# Altium schematic sheet Bitcoiner_EB_Project_V1I1_Schematic.SchDoc: Bitcoiner Expansion Board (part 2 of 3)
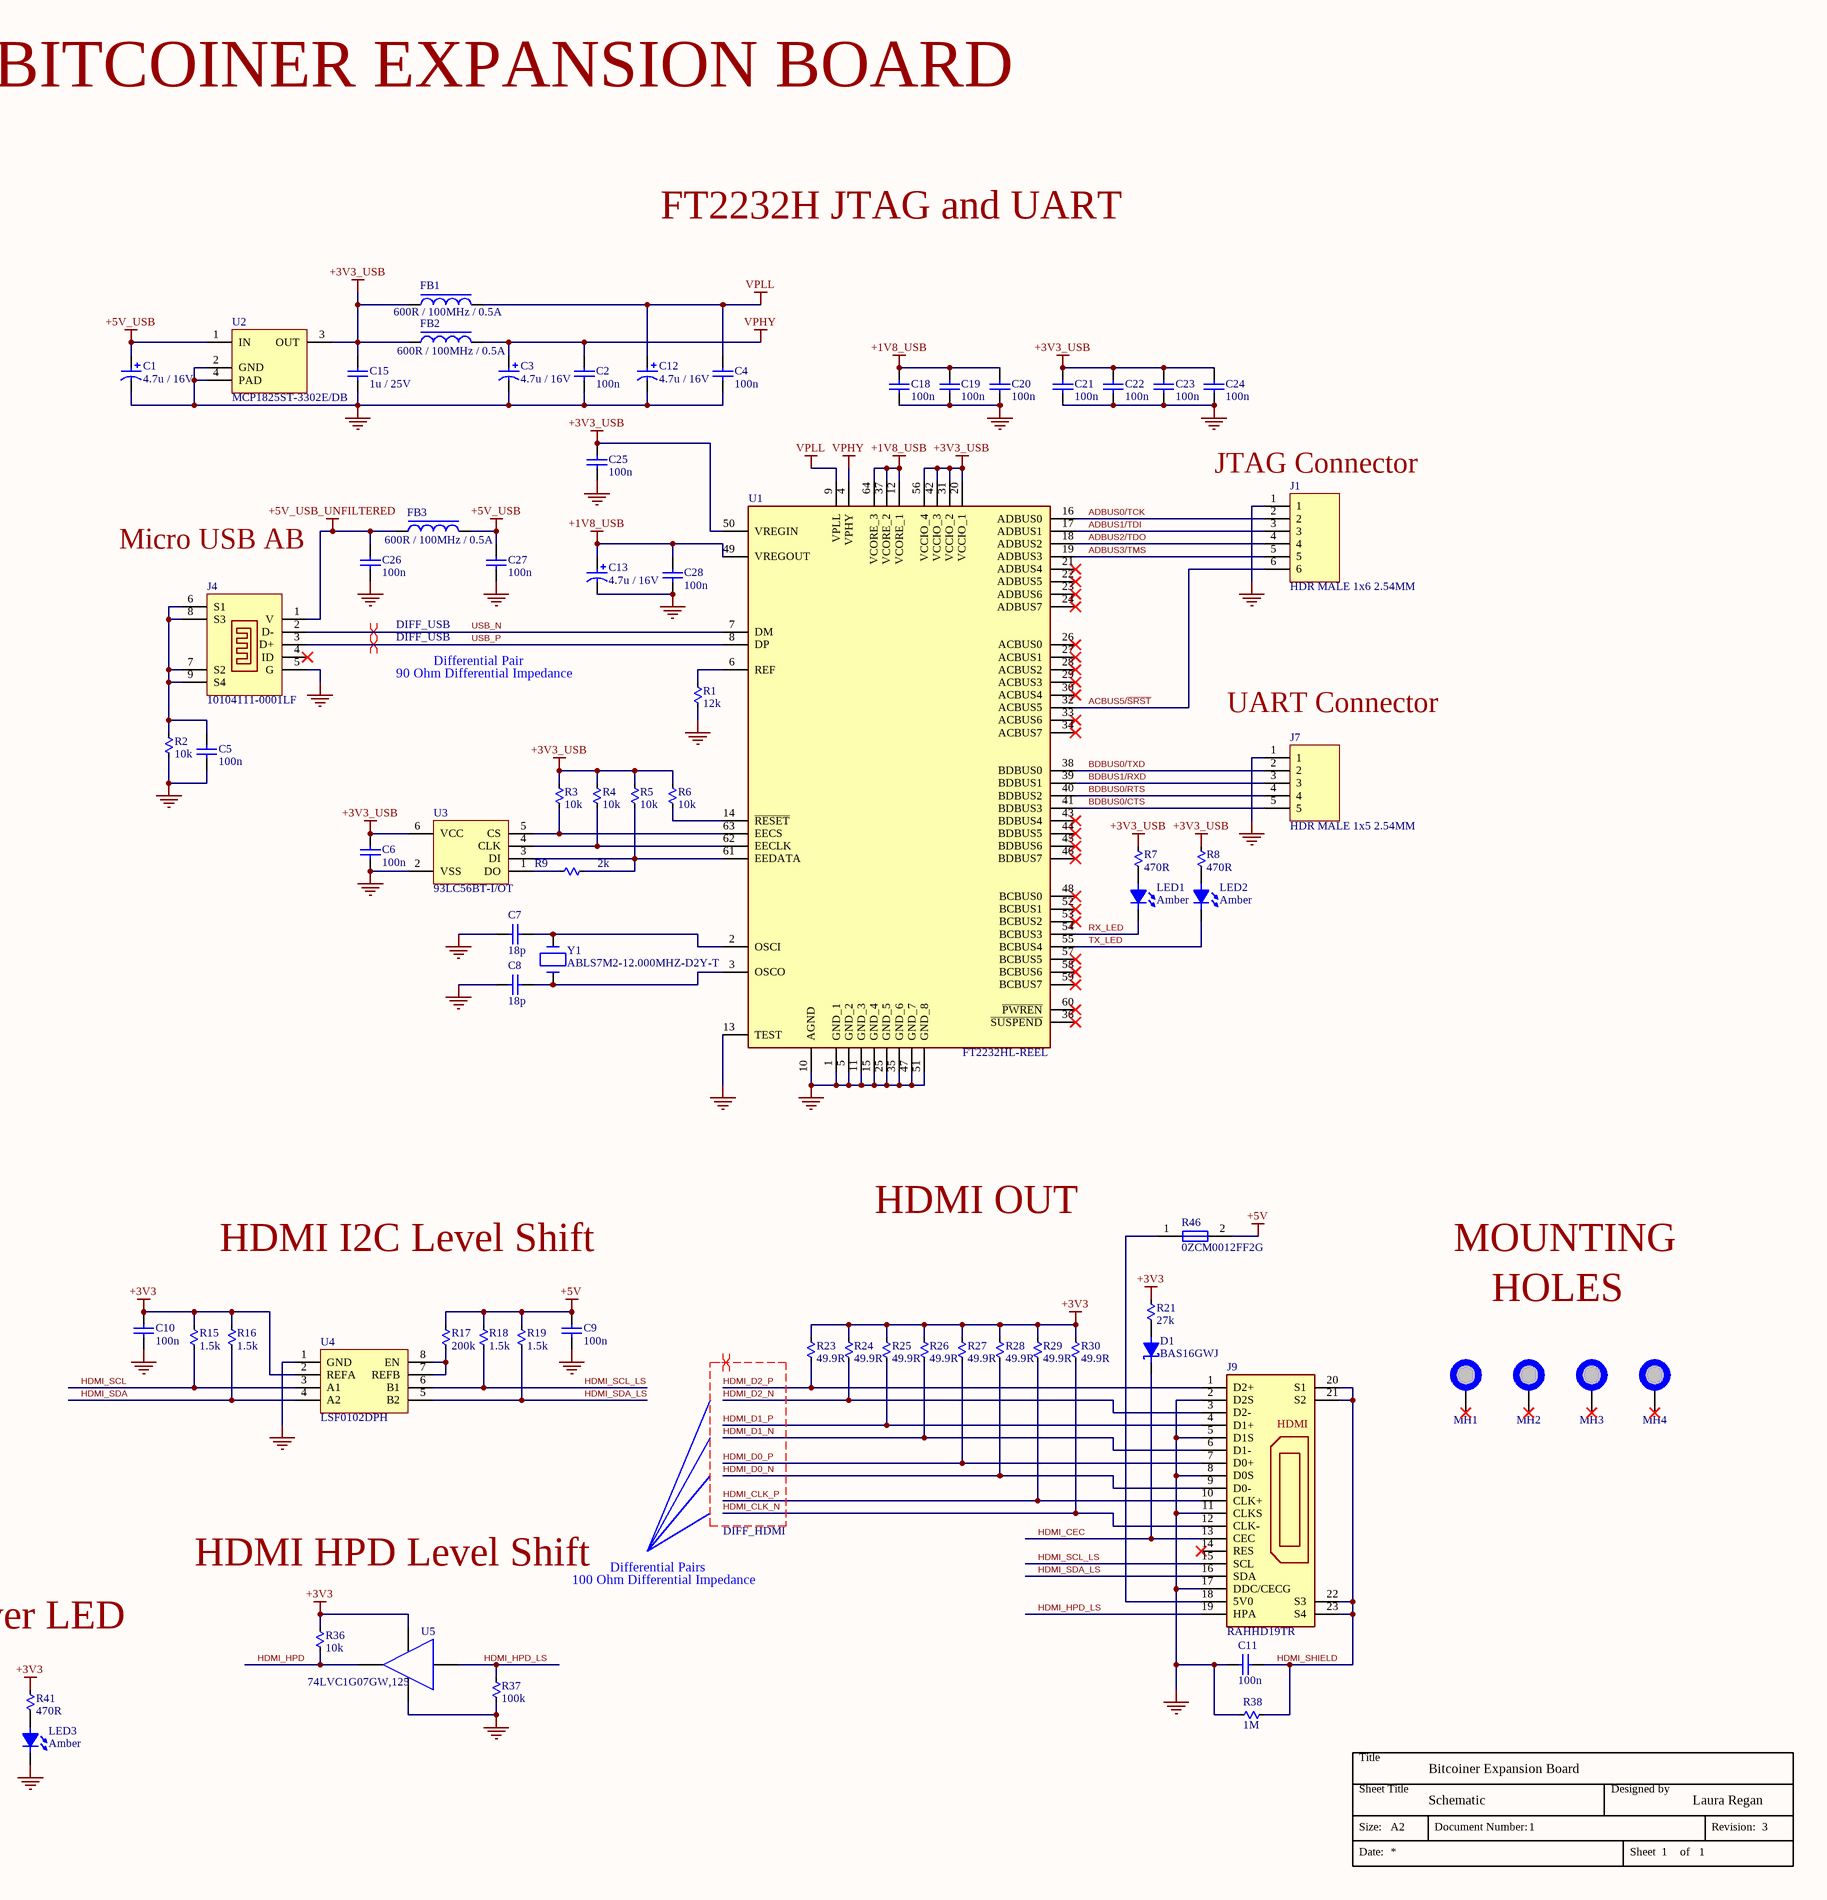
[diagram p2: Bitcoiner_EB_Project_V1I1_Schematic.SchDoc, right]
## Library data of the parts
C1 C3 C12 C13 C33 = T491A475K016AT: Tantalum capacitor 4.7 uF 16 VDC, T491A475K016AT, KEMET; Capacitance: 4.7uF; Tolerance: 10%; ESR (Equivalent Series Resistance): 4R; Polarity: Polar; Dissipation Factor: 6%; Life (Hours): 2000Hour; Ripple Current: 137mA; Leakage Current: 800nA; Supplier 1: Mouser; Manufacturer: KEMET; Manufacturer Part Number: T491A475K016AT; RoHS: Yes; Category: Tantalum Capacitors; Stock 1: 9766; Pricing 1: 1=0.43000, 10=0.24500, 50=0.24500, 100=0.14900, 1000=0.12200, 10000=0.10600 (USD); Mount: Surface Mount,PCB; Case/Package: 1206; Number of Pins: 2; Case Code (Metric): 3216; Case Code (Imperial): 1206; Dielectric Material: Tantalum; Min Operating Temperature: -55°C; Max Operating Temperature: 125°C; Packaging: Tape and Reel; Construction: Flat; Voltage Rating: 16V; Features: General Purpose; Package Quantity: 1; Voltage Rating (DC): 16V; Termination: SMD/SMT; Voltage: 16V; Series: T491; Length: 3.2mm; Width: 1.6mm; Height: 1.6mm; Depth: 1.6mm; Height - Seated (Max): 0.071inch; Radiation Hardening: No; RoHS Compliant: Yes; Lead Free: Lead Free; REACH SVHC: No SVHC; ComponentLink1URL: https://datasheet.ciiva.com/34302/1573425-34302513.pdf?src-supplier=Jameco; ComponentLink1Description: https://datasheet.ciiva.com/34302/1573425-34302513.pdf?src-supplier=Jameco; ComponentLink2URL: https://datasheet.ciiva.com/11793/0900766b80718482-11793043.pdf?src-supplier=RSComponents; ComponentLink2Description: https://datasheet.ciiva.com/11793/0900766b80718482-11793043.pdf?src-supplier=RSComponents; ComponentLink3URL: https://datasheet.ciiva.com/20171/458253-da-en-01-20171911.pdf?src-supplier=Rapid+Electronics; ComponentLink3Description: https://datasheet.ciiva.com/20171/458253-da-en-01-20171911.pdf?src-supplier=Rapid+Electronics; ComponentLink4URL: https://datasheet.ciiva.com/257/kem-t2005-t491-257536.pdf?src-supplier=Digi-Key; ComponentLink4Description: https://datasheet.ciiva.com/257/kem-t2005-t491-257536.pdf?src-supplier=Digi-Key; ComponentLink5URL: https://datasheet.ciiva.com/257/kem-t2005-t491-257537.pdf?src-supplier=Digi-Key; ComponentLink5Description: https://datasheet.ciiva.com/257/kem-t2005-t491-257537.pdf?src-supplier=Digi-Key; ComponentLink6URL: https://datasheet.ciiva.com/257/kem-t2005-t491-257538.pdf?src-supplier=Digi-Key; ComponentLink6Description: https://datasheet.ciiva.com/257/kem-t2005-t491-257538.pdf?src-supplier=Digi-Key; ComponentLink7URL: https://datasheet.ciiva.com/7696/1854511-7696309.pdf?src-supplier=Element14; ComponentLink7Description: https://datasheet.ciiva.com/7696/1854511-7696309.pdf?src-supplier=Element14; ComponentLink8URL: https://datasheet.ciiva.com/14605/70095774-14605189.pdf?src-supplier=Allied+Electronics; ComponentLink8Description: https://datasheet.ciiva.com/14605/70095774-14605189.pdf?src-supplier=Allied+Electronics; ComponentLink9URL: https://datasheet.ciiva.com/7696/1854511-7696310.pdf?src-supplier=Element14; ComponentLink9Description: https://datasheet.ciiva.com/7696/1854511-7696310.pdf?src-supplier=Element14; ComponentLink10URL: https://datasheet.ciiva.com/7696/1854511-7696311.pdf?src-supplier=Element14; ComponentLink10Description: https://datasheet.ciiva.com/7696/1854511-7696311.pdf?src-supplier=Element14; ComponentLink11URL: https://datasheet.ciiva.com/7696/1854511-7696312.pdf?src-supplier=Element14; ComponentLink11Description: https://datasheet.ciiva.com/7696/1854511-7696312.pdf?src-supplier=Element14; ComponentLink12URL: https://datasheet.ciiva.com/12883/kem-t2005-t491-12883130.pdf?src-supplier=Mouser; ComponentLink12Description: https://datasheet.ciiva.com/12883/kem-t2005-t491-12883130.pdf?src-supplier=Mouser; ComponentLink13URL: https://datasheet.ciiva.com/14603/70095774-14603739.pdf?src-supplier=Allied+Electronics; ComponentLink13Description: https://datasheet.ciiva.com/14603/70095774-14603739.pdf?src-supplier=Allied+Electronics; ComponentLink14URL: https://datasheet.ciiva.com/5934/kem-t2005-t491-5934799.pdf?src-supplier=Farnell; ComponentLink14Description: https://datasheet.ciiva.com/5934/kem-t2005-t491-5934799.pdf?src-supplier=Farnell; ComponentLink15URL: https://datasheet.ciiva.com/29244/458253-da-01-en-tantal-kondensator-t491a475k016at-29244572.pdf?src-supplier=Conrad; ComponentLink15Description: https://datasheet.ciiva.com/29244/458253-da-01-en-tantal-kondensator-t491a475k016at-29244572.pdf?src-supplier=Conrad; Supplier Part Number 1: 80-T491A475K016
C2 C4-C6 C9-C11 C16 C18-C28 C30 = 08055C104KAT4A: AVX - 08055C104KAT4A - Multilayer Ceramic Capacitor, 0.1 F, 10%, X7R, 50 V, 0805 [2012 Metric] RoHS Compliant: Yes; Manufacturer: Kyocera AVX; Capacitance: 100nF; Voltage Rating: 50V; Dissipation Factor: 2.5%; Supplier 1: Mouser; Manufacturer Part Number: 08055C104KAT4A; RoHS: Yes; Category: Ceramic Capacitors; Stock 1: 466031; Pricing 1: 1=0.10000, 10=0.04000, 50=0.04000, 100=0.03300, 1000=0.01900, 10000=0.01500 (USD); Mount: Surface Mount; Case/Package: 0805; Number of Pins: 2; Case Code (Imperial): 0805; Case Code (Metric): 2012; Dielectric Material: Ceramic; Min Operating Temperature: -55°C; Max Operating Temperature: 125°C; Tolerance: 10%; Dielectric: X7R; Packaging: Tape and Reel; Voltage Rating (DC): 50V; Package Quantity: 15000; Termination: SMD/SMT; Voltage: 50V; Construction: Flat; Length: 2.01mm; Width: 1.25mm; Height: 0.94mm; Depth: 1.25mm; Radiation Hardening: No; REACH SVHC: No SVHC; Lead Free: Lead Free; RoHS Compliant: Yes; ComponentLink1URL: https://datasheet.ciiva.com/2988/cx7r-2988016.pdf?src-supplier=Avnet; ComponentLink1Description: https://datasheet.ciiva.com/2988/cx7r-2988016.pdf?src-supplier=Avnet; ComponentLink2URL: https://datasheet.ciiva.com/28613/1679506-28613114.pdf?src-supplier=Element14; ComponentLink2Description: https://datasheet.ciiva.com/28613/1679506-28613114.pdf?src-supplier=Element14; ComponentLink3URL: https://datasheet.ciiva.com/5423/cx7r-218113-5423437.pdf?src-supplier=Mouser; ComponentLink3Description: https://datasheet.ciiva.com/5423/cx7r-218113-5423437.pdf?src-supplier=Mouser; ComponentLink4URL: https://datasheet.ciiva.com/16222/cx7r-16222253.pdf?src-supplier=Future+Electronics; ComponentLink4Description: https://datasheet.ciiva.com/16222/cx7r-16222253.pdf?src-supplier=Future+Electronics; ComponentLink5URL: https://datasheet.ciiva.com/22676/1679506-22676605.pdf?src-supplier=Element14; ComponentLink5Description: https://datasheet.ciiva.com/22676/1679506-22676605.pdf?src-supplier=Element14; ComponentLink6URL: https://datasheet.ciiva.com/2988/cx7r-2988015.pdf?src-supplier=Avnet; ComponentLink6Description: https://datasheet.ciiva.com/2988/cx7r-2988015.pdf?src-supplier=Avnet; Supplier Part Number 1: 581-08055C104KAT4A
C7 C8 = C0805C180J5GAC: Cap Ceramic 18pF 50V C0G 5% Pad SMD 0805 125°C Extreme Low ESR Bag; Manufacturer: KEMET; Supplier 1: Mouser; Manufacturer Part Number: C0805C180J5GAC; RoHS: Yes; Category: Ceramic Capacitors; Stock 1: 13285; Pricing 1: 1=0.11000, 10=0.04800, 50=0.04800, 100=0.03400, 1000=0.02300, 10000=0.01600 (USD); Mount: Surface Mount; Case/Package: 0805; Number of Pins: 2; Dielectric Material: Ceramic; Case Code (Imperial): 0805; Case Code (Metric): 2012; Min Operating Temperature: -55°C; Max Operating Temperature: 125°C; Capacitance: 18pF; Tolerance: 5%; Dielectric: C0G; Voltage Rating (DC): 50V; Packaging: Tape and Reel; Termination: SMD/SMT; Package Quantity: 4000; Series: C0805C; Construction: Flat; Length: 2mm; Width: 1.2mm; Height: 0.78mm; Depth: 1.25mm; Radiation Hardening: No; Lead Free: Lead Free; RoHS Compliant: Yes; ComponentLink1URL: https://datasheet.ciiva.com/11651/kem-c1003-c0g-smd-11651038.pdf?src-supplier=Avnet; ComponentLink1Description: https://datasheet.ciiva.com/11651/kem-c1003-c0g-smd-11651038.pdf?src-supplier=Avnet; Supplier Part Number 1: 80-C0805C180J5GAC
C14 C15 = C0805C105K3RAC7210: Cap Ceramic 1uF 25V X7R 10% SMD 0805 125C Plastic T/R; Manufacturer: KEMET; Supplier 1: Mouser; Manufacturer Part Number: C0805C105K3RAC7210; RoHS: Yes; Category: Ceramic Capacitors; Stock 1: 18487; Pricing 1: 1=0.14000, 10=0.05600, 50=0.05600, 100=0.04600, 1000=0.02700, 10000=0.02200 (USD); Mount: Surface Mount; Case/Package: 0805; Dielectric Material: Ceramic; Min Operating Temperature: -55°C; Max Operating Temperature: 125°C; Capacitance: 1uF; Tolerance: 10%; Dielectric: X7R; Packaging: Tape and Reel; Voltage Rating (DC): 25V; Construction: Flat; Length: 2mm; Height: 1.25mm; Depth: 1.25mm; Radiation Hardening: No; RoHS Compliant: Yes; ComponentLink1URL: https://datasheet.ciiva.com/16623/datasheetpn-c0805c105k3rac7210-16623618.pdf?src-supplier=Avnet+Europe; ComponentLink1Description: https://datasheet.ciiva.com/16623/datasheetpn-c0805c105k3rac7210-16623618.pdf?src-supplier=Avnet+Europe; ComponentLink2URL: https://datasheet.ciiva.com/26847/getdatasheetpartid-385653-26847803.pdf?src-supplier=Verical; ComponentLink2Description: https://datasheet.ciiva.com/26847/getdatasheetpartid-385653-26847803.pdf?src-supplier=Verical; Supplier Part Number 1: 80-C0805C105K3R7210
C17 C29 = GRM21BR61E106KA73K: CAP CER 10UF 25V X5R 0805; Manufacturer: Murata; Tolerance: 10%; Supplier 1: Mouser; Manufacturer Part Number: GRM21BR61E106KA73K; RoHS: Yes; Category: Ceramic Capacitors; Stock 1: 5264; Pricing 1: 1=0.23000, 10=0.09400, 50=0.09400, 100=0.08000, 1000=0.04900, 10000=0.03900 (USD); Mount: Surface Mount; Case/Package: 0805; Weight: 0.000335oz; Min Operating Temperature: -55°C; Max Operating Temperature: 85°C; Packaging: Tape and Reel; Capacitance: 10uF; Voltage Rating: 25V; Package Quantity: 10000; Dielectric: X5R; Voltage Rating (DC): 25V; Length: 0.079inch; Width: 0.049inch; Thickness: 0.055inch; RoHS Compliant: Yes; ComponentLink1URL: http://www.mouser.com/ds/2/281/c02e-2905.pdf?src-supplier=Mouser; ComponentLink1Description: http://www.mouser.com/ds/2/281/c02e-2905.pdf?src-supplier=Mouser; ComponentLink2URL: http://search.murata.co.jp/Ceramy/image/img/A01X/G101/ENG/GRM21BR61E106KA73-01.pdf?src-supplier=Digi-Key; ComponentLink2Description: http://search.murata.co.jp/Ceramy/image/img/A01X/G101/ENG/GRM21BR61E106KA73-01.pdf?src-supplier=Digi-Key; ComponentLink3URL: https://search.murata.co.jp/Ceramy/image/img/A01X/G101/ENG/GRM21BR61E106KA73-01.pdf?src-supplier=Digi-Key; ComponentLink3Description: https://search.murata.co.jp/Ceramy/image/img/A01X/G101/ENG/GRM21BR61E106KA73-01.pdf?src-supplier=Digi-Key; Supplier Part Number 1: 81-GRM21BR61E106KA3K
C31 C32 = CL21A226MPCLRNC: Cap Ceramic 22uF 10V X5R 20% SMD 0805 85C Cardboard T/R; Manufacturer: Samsung; Supplier 1: Mouser; Manufacturer Part Number: CL21A226MPCLRNC; RoHS: Yes; Category: Ceramic Capacitors; Stock 1: 45867; Pricing 1: 1=0.26000, 10=0.11700, 50=0.11700, 100=0.10000, 1000=0.06200, 10000=0.05400 (USD); Mount: Surface Mount; Case/Package: 0805; Case Code (Metric): 2012; Case Code (Imperial): 0805; Material: Ceramic; Contact Plating: Tin; Min Operating Temperature: -55°C; Max Operating Temperature: 85°C; Capacitance: 22uF; Tolerance: 20%; Dielectric: X5R; Packaging: Tape and Reel; Voltage Rating: 10V; Length: 2mm; Width: 0.049inch; Height: 0.85mm; Depth: 1.25mm; Thickness: 0.037inch; Radiation Hardening: No; ComponentLink1URL: https://datasheet.ciiva.com/15195/getdatasheetpartid-353187-15195862.pdf?src-supplier=Verical; ComponentLink1Description: https://datasheet.ciiva.com/15195/getdatasheetpartid-353187-15195862.pdf?src-supplier=Verical; ComponentLink2URL: https://datasheet.ciiva.com/25711/cl21a226mpclrnc-25711362.pdf?src-supplier=Digi-Key; ComponentLink2Description: https://datasheet.ciiva.com/25711/cl21a226mpclrnc-25711362.pdf?src-supplier=Digi-Key; ComponentLink3URL: https://datasheet.ciiva.com/29199/454635-da-01-en-vs-kondensator-0805-29199617.pdf?src-supplier=Conrad; ComponentLink3Description: https://datasheet.ciiva.com/29199/454635-da-01-en-vs-kondensator-0805-29199617.pdf?src-supplier=Conrad; ComponentLink4URL: https://datasheet.ciiva.com/16428/cl05b104kq5nnnc-16428876.pdf?src-supplier=Future+Electronics; ComponentLink4Description: https://datasheet.ciiva.com/16428/cl05b104kq5nnnc-16428876.pdf?src-supplier=Future+Electronics; Supplier Part Number 1: 187-CL21A226MPCLRNC
D1 = BAS16GWJ: High-speed switching diode BAS16GW/SOD2/REEL 13 Q1/T1 S"; Manufacturer: Nexperia; Supplier 1: Mouser; Manufacturer Part Number: BAS16GWJ; RoHS: Yes; Category: Rectifier Diodes; Stock 1: 2099; Pricing 1: 1=0.11000, 10=0.07700, 50=0.07700, 100=0.04100, 1000=0.01900, 10000=0.01200 (USD); ComponentLink1URL: https://assets.nexperia.com/documents/data-sheet/BAS16GW.pdf?src-supplier=Digi-Key; ComponentLink1Description: https://assets.nexperia.com/documents/data-sheet/BAS16GW.pdf?src-supplier=Digi-Key; Supplier Part Number 1: 841-BAS16GWJ
DS1 = LDD-E2802RD: Dual Digit 565 nm Green 0.28 inch Common Anode Seven Segment Display; Manufacturer: Lumex; Wavelength: 565nm; Forward Current: 10mA; Forward Voltage: 2.2V; Power Consumption: 105mW; Number of LEDs: 16; Viewing Area (height): 7mm; Supplier 1: Mouser; Manufacturer Part Number: LDD-E2802RD; RoHS: Yes; Category: Uncategorized; Stock 1: 124; Pricing 1: 1=1.27000, 10=0.80000, 50=0.80000, 100=0.64000, 1000=0.44700, 10000=0.40000 (USD); Mount: Through Hole; Number of Pins: 10; Color: Green; Min Operating Temperature: -30°C; Max Operating Temperature: 85°C; Element Configuration: Common Anode; Illumination Color: Green; Packaging: Rail/Tube; Display Type: Segment; Lead Free: Lead Free; RoHS Compliant: No; ComponentLink1URL: https://datasheet.ciiva.com/12093/ldd-e2802rd-106744-12093301.pdf?src-supplier=Mouser; ComponentLink1Description: https://datasheet.ciiva.com/12093/ldd-e2802rd-106744-12093301.pdf?src-supplier=Mouser; Supplier Part Number 1: 696-LDD-E2802RD
FB1-FB3 = MMZ2012R601AT000: TDK         MMZ2012R601AT000            FERRITE BEAD, 0.2OHM, 500MA, 0805; Tolerance: 25%; DC Resistance (DCR): 200mR; Supplier 1: Mouser; Manufacturer: TDK; Manufacturer Part Number: MMZ2012R601AT000; RoHS: Yes; Category: Inductors; Stock 1: 23788; Pricing 1: 1=0.10000, 10=0.05100, 50=0.05100, 100=0.03600, 1000=0.02600, 10000=0.02000 (USD); Mount: Surface Mount; Case/Package: 0805; Number of Pins: 2; Core Material: Ferrite; Case Code (Metric): 2012; Case Code (Imperial): 0805; Impedance: 600R; Packaging: Cut Tape; Package Quantity: 1; Current Rating: 500mA; Max DC Current: 500mA; Series: MMZ; Length: 0.079inch; Width: 0.049inch; Height: 0.041inch; Depth: 1.25mm; RoHS Compliant: Yes; REACH SVHC: No SVHC; ComponentLink1URL: https://datasheet.ciiva.com/8077/55163-8077040.pdf?src-supplier=Element14; ComponentLink1Description: https://datasheet.ciiva.com/8077/55163-8077040.pdf?src-supplier=Element14; ComponentLink2URL: https://datasheet.ciiva.com/46634/beads-commercial-signal-mmz-en-46634123.pdf?src-supplier=Digi-Key; ComponentLink2Description: https://datasheet.ciiva.com/46634/beads-commercial-signal-mmz-en-46634123.pdf?src-supplier=Digi-Key; ComponentLink3URL: https://datasheet.ciiva.com/46634/beads-commercial-signal-mmz-en-46634155.pdf?src-supplier=Digi-Key; ComponentLink3Description: https://datasheet.ciiva.com/46634/beads-commercial-signal-mmz-en-46634155.pdf?src-supplier=Digi-Key; ComponentLink4URL: https://datasheet.ciiva.com/46381/712877-46381661.pdf?src-supplier=Element14; ComponentLink4Description: https://datasheet.ciiva.com/46381/712877-46381661.pdf?src-supplier=Element14; ComponentLink5URL: https://datasheet.ciiva.com/46634/beads-commercial-signal-mmz-en-46634125.pdf?src-supplier=Digi-Key; ComponentLink5Description: https://datasheet.ciiva.com/46634/beads-commercial-signal-mmz-en-46634125.pdf?src-supplier=Digi-Key; ComponentLink6URL: https://datasheet.ciiva.com/8077/55163-8077039.pdf?src-supplier=Element14; ComponentLink6Description: https://datasheet.ciiva.com/8077/55163-8077039.pdf?src-supplier=Element14; Supplier Part Number 1: 810-MMZ2012R601AT000
J1 = G800W302018EU: Manufacturer: Amphenol; Supplier 1: Mouser; Manufacturer Part Number: G800W302018EU; RoHS: Yes; Stock 1: 12771; Pricing 1: 1=0.15000, 10=0.07700, 50=0.07700, 100=0.07400, 1000=0.06500, 10000=0.05300 (USD); RoHS Compliant: Yes; Supplier Part Number 1: 523-G800W302018EU
J2 J5 = SSW-106-02-T-D-RA: Connector; Manufacturer: SAMTEC; Datasheet Link: https://componentsearchengine.com//SSW-106-02-T-D-RA.pdf; Mouser2 Part Number: 200-SSW10602TDRA; Mouser2 Price/Stock: https://www.mouser.com/Search/Refine.aspx?Keyword=200-SSW10602TDRA; Manufacturer Part Number: SSW-106-02-T-D-RA; Supplier 1: Mouser; Supplier Part Number 1: 200-SSW10602TDRA; Stock 1: *
J4 = 10104111-0001LF: Conn USB Type A/B RCP 5 POS 0.65mm Solder RA SMD 5 Terminal 1 Port T/R; Manufacturer: AMPHENOL ICC (FCI); Number of Contacts: 5; Gender: Receptacle; Number of Ports: 1; Current Rating: 1.8A; Mating Cycles: 10000; Shielding: Shielded; Supplier 1: Mouser; Manufacturer Part Number: 10104111-0001LF; RoHS: No; Stock 1: 372; Pricing 1: 1=0.78000, 10=0.61900, 50=0.61900, 100=0.53800, 1000=0.43000, 10000=0.38500 (USD); Mount: Surface Mount; Contact Plating: Gold; Insulation Color: Grey; Min Operating Temperature: -30°C; Max Operating Temperature: 80°C; Connector Type: USB; Packaging: Cut Tape; Termination: Solder; Flammability Rating: UL94 V-0; ComponentLink1URL: http://www.farnell.com/datasheets/2366786.pdf?src-supplier=Farnell; ComponentLink1Description: http://www.farnell.com/datasheets/2366786.pdf?src-supplier=Farnell; ComponentLink2URL: https://cdn.amphenol-icc.com/media/wysiwyg/files/drawing/10104111.pdf?src-supplier=Digi-Key; ComponentLink2Description: https://cdn.amphenol-icc.com/media/wysiwyg/files/drawing/10104111.pdf?src-supplier=Digi-Key; ComponentLink3URL: http://www.farnell.com/datasheets/2366786.pdf?src-supplier=Newark; ComponentLink3Description: http://www.farnell.com/datasheets/2366786.pdf?src-supplier=Newark; ComponentLink4URL: http://www.farnell.com/datasheets/2366786.pdf?src-supplier=Element14; ComponentLink4Description: http://www.farnell.com/datasheets/2366786.pdf?src-supplier=Element14; Supplier Part Number 1: 649-10104111-0001LF
J7 = 10129378-905001BLF: HDR FEMALE 1x5 2.54MM; Manufacturer: Amphenol ICC; Supplier 1: Mouser; Manufacturer Part Number: 10129378-905001BLF; RoHS: No; Stock 1: 4420; Pricing 1: 1=0.18000, 10=0.08900, 50=0.08900, 100=0.08500, 1000=0.07400, 10000=0.06200 (USD); Supplier Part Number 1: 649-1012937890501BLF
J9 = RAHHD19TR: HDMI Connector; Manufacturer_Name: Switchcraft; Manufacturer: Switchcraft Conxall; Datasheet Link: https://www.switchcraft.com/Drawings/RAHHD19TR_CD.pdf; Height: 6.68mm; Manufacturer_Part_Number: RAHHD19TR; Supplier 1: Mouser; Manufacturer Part Number: RAHHD19TR; RoHS: No; Stock 1: 605; Pricing 1: 1=0.77000, 10=0.62400, 50=0.62400, 100=0.59200, 1000=0.49200, 10000=0.46800 (USD); Supplier Part Number 1: 502-RAHHD19TR
J10 = KLDX-0202-BC: Conn Power PIN 2 POS Solder RA Thru-Hole 3 Terminal 1 Port; Manufacturer: Kycon; Number of Contacts: 2; Gender: Female; Current Rating: 3.5A; Voltage Rating: 24V; Insulation Resistance: 100MR; Supplier 1: Mouser; Manufacturer Part Number: KLDX-0202-BC; RoHS: Yes; Category: Connectors; Stock 1: 4244; Pricing 1: 1=0.53000, 10=0.40100, 50=0.40100, 100=0.35100, 1000=0.27600, 10000=0.22200 (USD); Mount: Through Hole; Color: Black; Contact Material: Brass; Contact Plating: Tin; Housing Material: PBT; Min Operating Temperature: -25°C; Max Operating Temperature: 85°C; Package Quantity: 500; Packaging: Bag; Termination: Solder; Orientation: Right Angle; Series: KLDX; Contact Gender: Female; Connector Type: Power; Voltage Rating (DC): 24V; Radiation Hardening: No; RoHS Compliant: Yes; Flammability Rating: UL94 V-0; ComponentLink1URL: https://datasheet.ciiva.com/4561/kldx-0202-ac20-20bc-182163-4561492.pdf?src-supplier=Mouser; ComponentLink1Description: https://datasheet.ciiva.com/4561/kldx-0202-ac20-20bc-182163-4561492.pdf?src-supplier=Mouser; Supplier Part Number 1: 806-KLDX-0202-BC
J11 = G800W305018EU: HDR MALE 1x3 2.54MM; Manufacturer: Amphenol; Supplier 1: Mouser; Manufacturer Part Number: G800W305018EU; RoHS: Yes; Stock 1: 5972; Pricing 1: 1=0.10000, 10=0.04000, 50=0.04000, 100=0.03800, 1000=0.03200, 10000=0.02700 (USD); Supplier Part Number 1: 523-G800W305018EU
L1 = TYS60454R7M-10: Pwrind, SMT, Shld, Lrated / 6.0X6.0X4.5MM / Uom=ea / Wire Wound Inductive / Fixed Inductor; Manufacturer: Laird Steward; Tolerance: 20%; Inductance: 4.7uH; Saturation Current: 4.97A; Shielding: Shielded; DC Resistance (DCR): 26mR; Self Resonant Frequency: 24MHz; Test Frequency: 100kHz; Supplier 1: Mouser; Manufacturer Part Number: TYS60454R7M-10; RoHS: Yes; Category: Fixed Inductors; Stock 1: 5979; Pricing 1: 1=0.24000, 10=0.22900, 50=0.21200, 100=0.21000, 1000=0.16600, 10000=0.16100 (USD); Mount: Surface Mount; Case/Package: Nonstandard; Min Operating Temperature: -40°C; Max Operating Temperature: 125°C; Packaging: Tape and Reel; Resistor Type: Wirewound; Current Rating: 3.3A; Max DC Current: 3.3A; Length: 0.236inch; Width: 0.236inch; Height - Seated (Max): 0.185inch; Ratings: AEC-Q200; RoHS Compliant: Yes; ComponentLink1URL: http://assets.lairdtech.com/home/brandworld/files/TYS60454R7M-10.pdf?src-supplier=Digi-Key; ComponentLink1Description: http://assets.lairdtech.com/home/brandworld/files/TYS60454R7M-10.pdf?src-supplier=Digi-Key; ComponentLink2URL: http://www.lairdtech.com/WorkArea/linkit.aspx?LinkIdentifier=id&ItemID=2147484897&src-supplier=Avnet; ComponentLink2Description: http://www.lairdtech.com/WorkArea/linkit.aspx?LinkIdentifier=id&ItemID=2147484897&src-supplier=Avnet; Supplier Part Number 1: 875-TYS60454R7M-10
LED1-LED3 = IN-S63AT5A: LED Uni-Color Amber 609nm Automotive 2-Pin Chip 0603(1608Metric) T/R; Manufacturer: Inolux; Color: Orange; Lens Color: Clear; Lens Style: Flat; Luminous Intensity: 45mcd; Forward Voltage: 1.9V; Test Current: 5mA; Viewing Angle: 120°; Dominant Wavelength: 605nm; Lens Size: 0.8mm; Supplier 1: Mouser; Manufacturer Part Number: IN-S63AT5A; RoHS: No; Category: LEDs; Stock 1: 8000; Pricing 1: 1=0.34000, 10=0.18900, 50=0.18900, 100=0.07600, 1000=0.06300, 10000=0.04000 (USD); Mount: Surface Mount; Case/Package: 0603; Case Code (Imperial): 0603; Case Code (Metric): 1608; Packaging: Tape and Reel; Lens Transparency: Clear; Length: 1.6mm; Width: 0.8mm; Height: 0.4mm; ComponentLink1URL: http://www.inolux-corp.com/datasheet/SMDLED/Mono%20Color%20Top%20View/IN-S63AT%20Series_V1.1.pdf?src-supplier=Digi-Key; ComponentLink1Description: http://www.inolux-corp.com/datasheet/SMDLED/Mono%20Color%20Top%20View/IN-S63AT%20Series_V1.1.pdf?src-supplier=Digi-Key; Supplier Part Number 1: 743-IN-S63AT5A
LINK1 = 382811-8: CONN SHUNT 2POS OPEN 2.54MM; Manufacturer: TE Connectivity; Number of Contacts: 2; Insulation Resistance: 1GR; Contact Current Rating: 3A; Plating Thickness: 0.127um; Approvals: UL,CSA; Supplier 1: Mouser; Manufacturer Part Number: 382811-8; RoHS: Yes; Category: Board to Board Connectors; Stock 1: 1961; Pricing 1: 1=0.20000, 10=0.16400, 50=0.16400, 100=0.12500, 500=0.11300, 1000=0.09200, 2500=0.08400, 5000=0.08100, 10000=0.07300, 25000=0.06700 (USD); Housing Color: Black; Contact Plating: Gold; Housing Material: Polyester; Contact Material: Bronze; Color: Black; Min Operating Temperature: -65°C; Max Operating Temperature: 105°C; Number of Rows: 1; Packaging: Box; Number of Positions: 2; Orientation: Straight; Package Quantity: 1500; Current Rating: 3A; Contact Gender: Female; Length: 5.08mm; Height: 6.35mm; Depth: 2.54mm; Pitch: 2.54mm; Radiation Hardening: No; Lead Free: Lead Free; Flammability Rating: UL94 V-0; ELV: Compliant; REACH SVHC: Unknown; ComponentLink1URL: https://datasheet.ciiva.com/25616/0900766b810caf26-25616808.pdf?src-supplier=RSComponents; ComponentLink1Description: https://datasheet.ciiva.com/25616/0900766b810caf26-25616808.pdf?src-supplier=RSComponents; ComponentLink2URL: https://datasheet.ciiva.com/767/eng-cd-382811-l-767846.pdf?src-supplier=Digi-Key; ComponentLink2Description: https://datasheet.ciiva.com/767/eng-cd-382811-l-767846.pdf?src-supplier=Digi-Key; ComponentLink3URL: https://datasheet.ciiva.com/16547/eng-cs-1307819-section-6-7and8-0808-16547046.pdf?src-supplier=Avnet+Europe; ComponentLink3Description: https://datasheet.ciiva.com/16547/eng-cs-1307819-section-6-7and8-0808-16547046.pdf?src-supplier=Avnet+Europe; ComponentLink4URL: https://datasheet.ciiva.com/1412/eng-cs-1307819-section-6-7and8-0808-1412631.pdf?src-supplier=Element14; ComponentLink4Description: https://datasheet.ciiva.com/1412/eng-cs-1307819-section-6-7and8-0808-1412631.pdf?src-supplier=Element14; ComponentLink5URL: https://datasheet.ciiva.com/14640/70083050-14640423.pdf?src-supplier=Allied+Electronics; ComponentLink5Description: https://datasheet.ciiva.com/14640/70083050-14640423.pdf?src-supplier=Allied+Electronics; ComponentLink6URL: https://datasheet.ciiva.com/16469/eng-cs-1307819-section-6-7and8-0808-16469032.pdf?src-supplier=Avnet+Asia; ComponentLink6Description: https://datasheet.ciiva.com/16469/eng-cs-1307819-section-6-7and8-0808-16469032.pdf?src-supplier=Avnet+Asia; ComponentLink7URL: https://datasheet.ciiva.com/3120/eng-cs-1307819-section-6-7and8-0808-3120187.pdf?src-supplier=Avnet; ComponentLink7Description: https://datasheet.ciiva.com/3120/eng-cs-1307819-section-6-7and8-0808-3120187.pdf?src-supplier=Avnet; ComponentLink8URL: https://datasheet.ciiva.com/30253/eng-cs-1307819-section-6-7and8-0808-30253247.pdf?src-supplier=Onlinecomponents.com; ComponentLink8Description: https://datasheet.ciiva.com/30253/eng-cs-1307819-section-6-7and8-0808-30253247.pdf?src-supplier=Onlinecomponents.com; Supplier Part Number 1: 571-3828118
MH1-MH4 = MH_7.4MMNC_3.2MMD: Mounting Hole 7.4mm Diameter (Non Copper), 3.2 Drill NPTH
Q1 = BC857BS,115: NEXPERIA - BC857BS,115 - TRANSISTOR, DUAL, PNP, SC-88; Supplier 1: Mouser; Manufacturer: Nexperia; Manufacturer Part Number: BC857BS,115; RoHS: Yes; Category: BJTs; Stock 1: 20332; Pricing 1: 1=0.19000, 10=0.12200, 50=0.12200, 100=0.06800, 1000=0.03800, 10000=0.02500 (USD); RoHS Compliant: Yes; ComponentLink1URL: http://www.farnell.com/datasheets/708560.pdf?src-supplier=Farnell; ComponentLink1Description: http://www.farnell.com/datasheets/708560.pdf?src-supplier=Farnell; ComponentLink2URL: https://assets.nexperia.com/documents/data-sheet/BC857BS.pdf?src-supplier=Digi-Key; ComponentLink2Description: https://assets.nexperia.com/documents/data-sheet/BC857BS.pdf?src-supplier=Digi-Key; Supplier Part Number 1: 771-BC857BS-T/R
R1 = RC0805FR-0712KL: Res Thick Film 0805 12K Ohm 1% 0.125W(1/8W) ±100ppm/C Molded SMD Paper T/R; Manufacturer: Yageo; Resistance: 12kR; Temperature Coefficient: 100ppm/°C; Power Rating: 125mW; Voltage Rating: 150V; Supplier 1: Mouser; Manufacturer Part Number: RC0805FR-0712KL; RoHS: Yes; Category: Chip SMD Resistors; Stock 1: 94553; Pricing 1: 1=0.13000, 10=0.03100, 50=0.03100, 100=0.01100, 1000=0.00800, 10000=0.00500 (USD); Case/Package: 0805; Case Code (Imperial): 0805; Case Code (Metric): 2012; Weight: 0.000194oz; Size Code: 0805; Min Operating Temperature: -55°C; Max Operating Temperature: 155°C; Tolerance: 1%; Packaging: Tape and Reel; Resistor Type: Thick Film; Package Quantity: 1; Termination: SMD/SMT; Number of Terminations: 2; Max Power Dissipation: 125mW; Features: Moisture Resistant; Series: RC; Resistance Tolerance: 1%; Construction: Rectangular; Length: 2mm; Width: 1.25mm; Height: 0.024inch; Depth: 1.25mm; REACH SVHC: Unknown; Lead Free: Lead Free; Military Standard: Not; RoHS Compliant: Yes; ComponentLink1URL: https://datasheet.ciiva.com/12577/rc0805-12577253.pdf?src-supplier=Mouser; ComponentLink1Description: https://datasheet.ciiva.com/12577/rc0805-12577253.pdf?src-supplier=Mouser; ComponentLink2URL: https://datasheet.ciiva.com/2519/pyu-r-int-thick-7-2519831.pdf?src-supplier=Digi-Key; ComponentLink2Description: https://datasheet.ciiva.com/2519/pyu-r-int-thick-7-2519831.pdf?src-supplier=Digi-Key; ComponentLink3URL: https://datasheet.ciiva.com/2519/pyu-r-int-thick-7-2519832.pdf?src-supplier=Digi-Key; ComponentLink3Description: https://datasheet.ciiva.com/2519/pyu-r-int-thick-7-2519832.pdf?src-supplier=Digi-Key; ComponentLink4URL: https://datasheet.ciiva.com/2519/pyu-r-int-thick-7-2519833.pdf?src-supplier=Digi-Key; ComponentLink4Description: https://datasheet.ciiva.com/2519/pyu-r-int-thick-7-2519833.pdf?src-supplier=Digi-Key; ComponentLink5URL: https://datasheet.ciiva.com/17018/rc0805-17018634.pdf?src-supplier=Future+Electronics; ComponentLink5Description: https://datasheet.ciiva.com/17018/rc0805-17018634.pdf?src-supplier=Future+Electronics; ComponentLink6URL: https://datasheet.ciiva.com/7941/444164-7941693.pdf?src-supplier=Element14; ComponentLink6Description: https://datasheet.ciiva.com/7941/444164-7941693.pdf?src-supplier=Element14; ComponentLink7URL: https://datasheet.ciiva.com/7941/444164-7941694.pdf?src-supplier=Element14; ComponentLink7Description: https://datasheet.ciiva.com/7941/444164-7941694.pdf?src-supplier=Element14; Supplier Part Number 1: 603-RC0805FR-0712KL
R2-R6 R10-R13 R36 R43 = RC0805FR-0710KL: RES SMD 10K OHM 1% 1/8W 0805; Manufacturer: Yageo; Resistance: 10kR; Temperature Coefficient: 100ppm/°C; Power Rating: 125mW; Voltage Rating: 150V; Supplier 1: Mouser; Manufacturer Part Number: RC0805FR-0710KL; RoHS: Yes; Category: Chip SMD Resistors; Stock 1: 2657423; Pricing 1: 1=0.10000, 10=0.03100, 50=0.03100, 100=0.01200, 1000=0.00700, 10000=0.00400 (USD); Case/Package: 0805; Case Code (Imperial): 0805; Case Code (Metric): 2012; Size Code: 0805; Min Operating Temperature: -55°C; Max Operating Temperature: 155°C; Tolerance: 1%; Resistor Type: Thick Film; Packaging: Tape and Reel; Package Quantity: 1; Termination: SMD/SMT; Number of Terminations: 2; Max Power Dissipation: 125mW; Features: Moisture Resistant; Series: RC; Construction: Rectangular; Resistance Tolerance: 1%; Technology: THICK FILM; Length: 2mm; Width: 0.049inch; Height: 0.024inch; Depth: 1.25mm; REACH SVHC: Unknown; Lead Free: Lead Free; Military Standard: Not; RoHS Compliant: Yes; Supplier Part Number 1: 603-RC0805FR-0710KL
R7 R8 R41 = RC0805FR-07470RL: Res Thick Film 0805 470 Ohm 1% 1/8W +/-100ppm/ßC Molded SMD Paper T/R; Manufacturer: Yageo; Temperature Coefficient: 100ppm/°C; Voltage Rating (DC): 150V; Power Rating: 125mW; Supplier 1: Mouser; Manufacturer Part Number: RC0805FR-07470RL; RoHS: Yes; Category: Chip SMD Resistors; Stock 1: 63482; Pricing 1: 1=0.13000, 10=0.03100, 50=0.03100, 100=0.01100, 1000=0.00800, 10000=0.00500 (USD); Case/Package: 0805; Number of Pins: 2; Case Code (Metric): 2012; Case Code (Imperial): 0805; Size Code: 0805; Min Operating Temperature: -55°C; Max Operating Temperature: 155°C; Resistance: 470R; Tolerance: 1%; Resistor Type: Thick Film; Packaging: Tape and Reel; Package Quantity: 5000; Voltage Rating: 150V; Number of Terminations: 2; Termination: SMD/SMT; Max Power Dissipation: 125mW; Features: Moisture Resistant; Series: RC; Resistance Tolerance: 1%; Construction: Rectangular; Length: 2mm; Width: 1.25mm; Height: 0.5mm; Depth: 1.25mm; Lead Pitch: 0.4mm; REACH SVHC: Unknown; Lead Free: Lead Free; Military Standard: Not; RoHS Compliant: Yes; ComponentLink1URL: https://datasheet.ciiva.com/2457/pyu-r-int-thick-7-2457056.pdf?src-supplier=Digi-Key; ComponentLink1Description: https://datasheet.ciiva.com/2457/pyu-r-int-thick-7-2457056.pdf?src-supplier=Digi-Key; ComponentLink2URL: https://datasheet.ciiva.com/2457/pyu-r-int-thick-7-2457057.pdf?src-supplier=Digi-Key; ComponentLink2Description: https://datasheet.ciiva.com/2457/pyu-r-int-thick-7-2457057.pdf?src-supplier=Digi-Key; ComponentLink3URL: https://datasheet.ciiva.com/2457/pyu-r-int-thick-7-2457058.pdf?src-supplier=Digi-Key; ComponentLink3Description: https://datasheet.ciiva.com/2457/pyu-r-int-thick-7-2457058.pdf?src-supplier=Digi-Key; ComponentLink4URL: https://datasheet.ciiva.com/7941/444164-7941797.pdf?src-supplier=Element14; ComponentLink4Description: https://datasheet.ciiva.com/7941/444164-7941797.pdf?src-supplier=Element14; ComponentLink5URL: https://datasheet.ciiva.com/7941/444164-7941798.pdf?src-supplier=Element14; ComponentLink5Description: https://datasheet.ciiva.com/7941/444164-7941798.pdf?src-supplier=Element14; ComponentLink6URL: https://datasheet.ciiva.com/46447/444164-46447580.pdf?src-supplier=Element14; ComponentLink6Description: https://datasheet.ciiva.com/46447/444164-46447580.pdf?src-supplier=Element14; ComponentLink7URL: https://datasheet.ciiva.com/16745/rc0805-16745229.pdf?src-supplier=Future+Electronics; ComponentLink7Description: https://datasheet.ciiva.com/16745/rc0805-16745229.pdf?src-supplier=Future+Electronics; Supplier Part Number 1: 603-RC0805FR-07470RL
R9 = RC0805FR-102KL: Res Thick Film 0805 2K Ohm 1% 1/8W 100ppm/C Molded SMD SMD Paper T/R; Manufacturer: Yageo; Resistance: 2kR; Temperature Coefficient: 100ppm/°C; Supplier 1: Mouser; Manufacturer Part Number: RC0805FR-102KL; RoHS: Yes; Category: Chip SMD Resistors; Stock 1: 19844; Pricing 1: 1=0.13000, 10=0.03100, 50=0.03100, 100=0.01100, 1000=0.00800, 10000=0.00500 (USD); Case/Package: 0805; Contact Plating: Tin,Matte; Min Operating Temperature: -55°C; Max Operating Temperature: 155°C; Tolerance: 1%; Resistor Type: Thick Film; Packaging: Tape and Reel; Construction: Rectangular; Length: 2mm; Depth: 1.25mm; Radiation Hardening: No; Military Standard: Not; RoHS Compliant: Yes; ComponentLink1URL: http://components.arrow.com/part/dataview/0323_06931434?src-supplier=Arrow+Europe; ComponentLink1Description: http://components.arrow.com/part/dataview/0323_06931434?src-supplier=Arrow+Europe; ComponentLink2URL: http://www.yageo.com/documents/recent/PYu-RC_Group_51_RoHS_L_2.pdf?src-supplier=Avnet; ComponentLink2Description: http://www.yageo.com/documents/recent/PYu-RC_Group_51_RoHS_L_2.pdf?src-supplier=Avnet; ComponentLink3URL: http://www.yageo.com/documents/recent/PYu-RC0805_51_RoHS_L_5.pdf?src-supplier=Avnet+Europe; ComponentLink3Description: http://www.yageo.com/documents/recent/PYu-RC0805_51_RoHS_L_5.pdf?src-supplier=Avnet+Europe; Supplier Part Number 1: 603-RC0805FR-102KL
R14 R20 R22 R31-R35 = RC0805FR-07200RL: Res Thick Film 2.0 x 1.2 mm 200 Ohm 1% 0.125W(1/8W) 100ppm/ C Molded SMD Paper T/R; Manufacturer: Yageo; Temperature Coefficient: 100ppm/°C; Voltage Rating (DC): 150V; Power Rating: 125mW; Supplier 1: Mouser; Manufacturer Part Number: RC0805FR-07200RL; RoHS: Yes; Category: Chip SMD Resistors; Stock 1: 137491; Pricing 1: 1=0.10000, 10=0.03500, 50=0.03500, 100=0.01200, 1000=0.00700, 10000=0.00400 (USD); Mount: Surface Mount; Case/Package: 0805; Case Code (Metric): 2012; Case Code (Imperial): 0805; Size Code: 0805; Min Operating Temperature: -55°C; Max Operating Temperature: 155°C; Tolerance: 1%; Resistance: 200R; Packaging: Tape and Reel; Resistor Type: Thick Film; Package Quantity: 1; Voltage Rating: 150V; Number of Terminations: 2; Termination: SMD/SMT; Max Power Dissipation: 125mW; Features: Moisture Resistant; Series: RC; Construction: Rectangular; Length: 2mm; Width: 0.049inch; Height: 0.024inch; Depth: 1.25mm; Lead Free: Lead Free; Military Standard: Not; RoHS Compliant: Yes; ComponentLink1URL: https://datasheet.ciiva.com/15189/getdatasheetpartid-327982-15189926.pdf?src-supplier=Verical; ComponentLink1Description: https://datasheet.ciiva.com/15189/getdatasheetpartid-327982-15189926.pdf?src-supplier=Verical; ComponentLink2URL: https://datasheet.ciiva.com/2519/pyu-r-int-thick-7-2519720.pdf?src-supplier=Digi-Key; ComponentLink2Description: https://datasheet.ciiva.com/2519/pyu-r-int-thick-7-2519720.pdf?src-supplier=Digi-Key; ComponentLink3URL: https://datasheet.ciiva.com/2519/pyu-r-int-thick-7-2519721.pdf?src-supplier=Digi-Key; ComponentLink3Description: https://datasheet.ciiva.com/2519/pyu-r-int-thick-7-2519721.pdf?src-supplier=Digi-Key; ComponentLink4URL: https://datasheet.ciiva.com/2519/pyu-r-int-thick-7-2519722.pdf?src-supplier=Digi-Key; ComponentLink4Description: https://datasheet.ciiva.com/2519/pyu-r-int-thick-7-2519722.pdf?src-supplier=Digi-Key; ComponentLink5URL: https://datasheet.ciiva.com/12667/rc0805-12667066.pdf?src-supplier=Mouser; ComponentLink5Description: https://datasheet.ciiva.com/12667/rc0805-12667066.pdf?src-supplier=Mouser; Supplier Part Number 1: 603-RC0805FR-07200RL
R15 R16 R18 R19 = RC0805FR-071K5L: Res Thick Film 0805 1.5K Ohm 1% 0.125W(1/8W) ±100ppm/C Molded SMD Paper T/R; Manufacturer: Yageo; Resistance: 1.5kR; Temperature Coefficient: 100ppm/°C; Power Rating: 125mW; Voltage Rating: 150V; Supplier 1: Mouser; Manufacturer Part Number: RC0805FR-071K5L; RoHS: Yes; Category: Chip SMD Resistors; Stock 1: 4290; Pricing 1: 1=0.13000, 10=0.03100, 50=0.03100, 100=0.01100, 1000=0.00800, 10000=0.00500 (USD); Case/Package: 0805; Case Code (Imperial): 0805; Case Code (Metric): 2012; Size Code: 0805; Min Operating Temperature: -55°C; Max Operating Temperature: 155°C; Tolerance: 1%; Packaging: Tape and Reel; Resistor Type: Thick Film; Package Quantity: 5000; Termination: SMD/SMT; Features: Moisture Resistant; Series: RC; Max Power Dissipation: 125mW; Number of Terminations: 2; Resistance Tolerance: 1%; Length: 2mm; Width: 1.25mm; Height: 0.5mm; Depth: 1.25mm; REACH SVHC: Unknown; Lead Free: Lead Free; RoHS Compliant: Yes; ComponentLink1URL: https://datasheet.ciiva.com/17423/rc0805-17423247.pdf?src-supplier=Future+Electronics; ComponentLink1Description: https://datasheet.ciiva.com/17423/rc0805-17423247.pdf?src-supplier=Future+Electronics; Supplier Part Number 1: 603-RC0805FR-071K5L
R17 = RC0805FR-07200KL: YAGEO - RC0805FR-07200KL - RES, THICK FILM, 200K, 1%, 0.125W, 0805, REEL; Resistance: 200kR; Temperature Coefficient: 100ppm/°C; Power Rating: 125mW; Voltage Rating: 150V; Supplier 1: Mouser; Manufacturer: Yageo; Manufacturer Part Number: RC0805FR-07200KL; RoHS: Yes; Category: Chip SMD Resistors; Stock 1: 217683; Pricing 1: 1=0.10000, 10=0.03100, 50=0.03100, 100=0.01200, 1000=0.00700, 10000=0.00400 (USD); Case/Package: 0805; Number of Pins: 2; Contact Plating: Tin,Matte; Case Code (Imperial): 0805; Case Code (Metric): 2012; Min Operating Temperature: -55°C; Max Operating Temperature: 155°C; Tolerance: 1%; Resistor Type: Thick Film; Packaging: Tape and Reel; Termination: SMD/SMT; Voltage Rating (DC): 150V; Working Voltage: 150V; Number of Terminations: 2; Features: Moisture Resistant; Series: RC; Max Power Dissipation: 125mW; Resistance Tolerance: 1%; Technology: THICK FILM; Construction: Rectangular; Length: 2mm; Height: 0.5mm; Depth: 1.25mm; Radiation Hardening: No; REACH SVHC: No SVHC; Military Standard: Not; Lead Free: Lead Free; RoHS Compliant: Yes; ComponentLink1URL: https://datasheet.ciiva.com/11808/0900766b8106beab-11808861.pdf?src-supplier=RSComponents; ComponentLink1Description: https://datasheet.ciiva.com/11808/0900766b8106beab-11808861.pdf?src-supplier=RSComponents; ComponentLink2URL: https://datasheet.ciiva.com/15189/getdatasheetpartid-71710-15189925.pdf?src-supplier=Verical; ComponentLink2Description: https://datasheet.ciiva.com/15189/getdatasheetpartid-71710-15189925.pdf?src-supplier=Verical; ComponentLink3URL: https://datasheet.ciiva.com/46395/444164-46395126.pdf?src-supplier=Element14; ComponentLink3Description: https://datasheet.ciiva.com/46395/444164-46395126.pdf?src-supplier=Element14; ComponentLink4URL: https://datasheet.ciiva.com/12668/rc0805-12668200.pdf?src-supplier=Mouser; ComponentLink4Description: https://datasheet.ciiva.com/12668/rc0805-12668200.pdf?src-supplier=Mouser; Supplier Part Number 1: 603-RC0805FR-07200KL
R21 = RE0805FRE0727KL: Chip Resistor Precision Grade Thick Film 0805 27kOhm 1% Paper T/R; Manufacturer: Yageo; Resistance: 27kR; Max Power Dissipation: 125mW; Temperature Coefficient: 50ppm/°C; Supplier 1: Mouser; Manufacturer Part Number: RE0805FRE0727KL; RoHS: Yes; Category: Chip SMD Resistors; Stock 1: 11410; Pricing 1: 1=0.14000, 10=0.03300, 50=0.03300, 100=0.01200, 1000=0.00900, 10000=0.00500 (USD); Case/Package: 0805; Min Operating Temperature: -55°C; Max Operating Temperature: 155°C; Packaging: Tape and Reel; Resistor Type: Thick Film; Number of Terminations: 2; Tolerance: 1%; Features: Moisture Resistant; Length: 0.079inch; Width: 0.049inch; Height: 0.024inch; RoHS Compliant: Yes; ComponentLink1URL: http://www.yageo.com/NewPortal/yageodocoutput?fileName=/pdf/R-Chip/PYu-RE_105_RoHS_L_4.pdf&src-supplier=Digi-Key; ComponentLink1Description: http://www.yageo.com/NewPortal/yageodocoutput?fileName=/pdf/R-Chip/PYu-RE_105_RoHS_L_4.pdf&src-supplier=Digi-Key; Supplier Part Number 1: 603-RE0805FRE0727KL
R23-R30 = CRCW060349R9FKEAHP: Res Thick Film 0603 49.9 Ohm 1% 0.33W(1/3W) ±100ppm/°C Pad SMD Automotive T/R; Manufacturer: Vishay Dale; Power Rating: 250mW; Voltage Rating: 75V; Max Power Dissipation: 333mW; Supplier 1: Mouser; Manufacturer Part Number: CRCW060349R9FKEAHP; RoHS: Yes; Category: Chip SMD Resistors; Stock 1: 295446; Pricing 1: 1=0.16, 10=0.14, 50=0.14, 100=0.051, 1000=0.023, 10000=0.02 (USD); Case/Package: 0603; Case Code (Imperial): 0603; Case Code (Metric): 1608; Min Operating Temperature: -55°C; Max Operating Temperature: 155°C; Resistance: 49.9R; Tolerance: 1%; Packaging: Tape and Reel; Package Quantity: 5000; Termination: SMD/SMT; Temperature Coefficient: 100ppm/°C; Length: 1.6mm; Width: 0.8mm; Height: 0.45mm; Depth: 0.85mm; RoHS Compliant: Yes; ComponentLink1URL: https://datasheet.ciiva.com/48525/crcwhpe3-48525900.pdf?src-supplier=Avnet; ComponentLink1Description: https://datasheet.ciiva.com/48525/crcwhpe3-48525900.pdf?src-supplier=Avnet; ComponentLink2URL: https://datasheet.ciiva.com/5547/crcwhpe3-46056-5547183.pdf?src-supplier=Mouser; ComponentLink2Description: https://datasheet.ciiva.com/5547/crcwhpe3-46056-5547183.pdf?src-supplier=Mouser; ComponentLink3URL: https://datasheet.ciiva.com/9003/crcwhpe3-9003461.pdf?src-supplier=Avnet; ComponentLink3Description: https://datasheet.ciiva.com/9003/crcwhpe3-9003461.pdf?src-supplier=Avnet; ComponentLink4URL: https://datasheet.ciiva.com/2578/crcwhpe3-2578507.pdf?src-supplier=Digi-Key; ComponentLink4Description: https://datasheet.ciiva.com/2578/crcwhpe3-2578507.pdf?src-supplier=Digi-Key; Supplier Part Number 1: 71-CRCW060349R9FKEAH; Contact Plating: Tin; Weight: 7.1E-05oz; Series: CRCW-HP; Number of Terminations: 2; Features: Automotive AEC-Q200; Technology: THICK FILM; Ratings: AEC-Q200; Radiation Hardening: No; Lead Free: Lead Free; ComponentLink5URL: https://datasheet.ciiva.com/2578/crcwhpe3-2578508.pdf?src-supplier=Digi-Key; ComponentLink5Description: https://datasheet.ciiva.com/2578/crcwhpe3-2578508.pdf?src-supplier=Digi-Key; ComponentLink6URL: https://datasheet.ciiva.com/2578/crcwhpe3-2578506.pdf?src-supplier=Digi-Key; ComponentLink6Description: https://datasheet.ciiva.com/2578/crcwhpe3-2578506.pdf?src-supplier=Digi-Key
R37 = RC0805FR-07100KL: YAGEO         RC0805FR-07100KL            RES, THICK FILM, 100K, 1%, 0.125W, 0805, REEL; Resistance: 100kR; Temperature Coefficient: 100ppm/°C; Power Rating: 125mW; Voltage Rating (DC): 150V; Supplier 1: Mouser; Manufacturer: Yageo; Manufacturer Part Number: RC0805FR-07100KL; RoHS: Yes; Category: Chip SMD Resistors; Stock 1: 419806; Pricing 1: 1=0.13000, 10=0.03100, 50=0.03100, 100=0.01100, 1000=0.00800, 10000=0.00400 (USD); Case/Package: 0805; Number of Pins: 2; Case Code (Metric): 2012; Case Code (Imperial): 0805; Size Code: 0805; Min Operating Temperature: -55°C; Max Operating Temperature: 155°C; Resistor Type: Thick Film; Tolerance: 1%; Packaging: Tape and Reel; Voltage Rating: 150V; Package Quantity: 1; Number of Terminations: 2; Termination: SMD/SMT; Max Power Dissipation: 125mW; Features: Moisture Resistant; Series: RC; Construction: Rectangular; Resistance Tolerance: 1%; Technology: THICK FILM; Length: 2mm; Width: 0.049inch; Height: 0.024inch; Depth: 1.25mm; Lead Pitch: 0.4mm; REACH SVHC: Unknown; Lead Free: Lead Free; RoHS Compliant: Yes; Military Standard: Not; ComponentLink1URL: https://datasheet.ciiva.com/11808/0900766b8106beab-11808858.pdf?src-supplier=RSComponents; ComponentLink1Description: https://datasheet.ciiva.com/11808/0900766b8106beab-11808858.pdf?src-supplier=RSComponents; ComponentLink2URL: https://datasheet.ciiva.com/2457/pyu-r-int-thick-7-2457017.pdf?src-supplier=Digi-Key; ComponentLink2Description: https://datasheet.ciiva.com/2457/pyu-r-int-thick-7-2457017.pdf?src-supplier=Digi-Key; ComponentLink3URL: https://datasheet.ciiva.com/12667/rc0805-12667001.pdf?src-supplier=Mouser; ComponentLink3Description: https://datasheet.ciiva.com/12667/rc0805-12667001.pdf?src-supplier=Mouser; ComponentLink4URL: https://datasheet.ciiva.com/2457/pyu-r-int-thick-7-2457018.pdf?src-supplier=Digi-Key; ComponentLink4Description: https://datasheet.ciiva.com/2457/pyu-r-int-thick-7-2457018.pdf?src-supplier=Digi-Key; ComponentLink5URL: https://datasheet.ciiva.com/16747/rc0805-16747226.pdf?src-supplier=Future+Electronics; ComponentLink5Description: https://datasheet.ciiva.com/16747/rc0805-16747226.pdf?src-supplier=Future+Electronics; ComponentLink6URL: https://datasheet.ciiva.com/2457/pyu-r-int-thick-7-2457019.pdf?src-supplier=Digi-Key; ComponentLink6Description: https://datasheet.ciiva.com/2457/pyu-r-int-thick-7-2457019.pdf?src-supplier=Digi-Key; ComponentLink7URL: https://datasheet.ciiva.com/7660/38627-7660796.pdf?src-supplier=Element14; ComponentLink7Description: https://datasheet.ciiva.com/7660/38627-7660796.pdf?src-supplier=Element14; ComponentLink8URL: https://datasheet.ciiva.com/7941/1697719-7941676.pdf?src-supplier=Element14; ComponentLink8Description: https://datasheet.ciiva.com/7941/1697719-7941676.pdf?src-supplier=Element14; ComponentLink9URL: https://datasheet.ciiva.com/7941/1686128-7941677.pdf?src-supplier=Element14; ComponentLink9Description: https://datasheet.ciiva.com/7941/1686128-7941677.pdf?src-supplier=Element14; ComponentLink10URL: https://datasheet.ciiva.com/7941/1697719-7941678.pdf?src-supplier=Element14; ComponentLink10Description: https://datasheet.ciiva.com/7941/1697719-7941678.pdf?src-supplier=Element14; ComponentLink11URL: https://datasheet.ciiva.com/22747/444164-22747534.pdf?src-supplier=Element14; ComponentLink11Description: https://datasheet.ciiva.com/22747/444164-22747534.pdf?src-supplier=Element14; Supplier Part Number 1: 603-RC0805FR-07100KL
R38 = RC0805FR-071ML: Res Thick Film 0805 1M Ohm 1% 0.125W(1/8W) ±100ppm/C Epoxy SMD T/R; Manufacturer: Yageo Phycomp; Temperature Coefficient: 100ppm/°C; Resistance: 1MR; Power Rating: 125mW; Voltage Rating (DC): 150V; Supplier 1: Mouser; Manufacturer Part Number: RC0805FR-071ML; RoHS: Yes; Category: Chip SMD Resistors; Stock 1: 51730; Pricing 1: 1=0.10000, 10=0.04000, 50=0.04000, 100=0.01600, 1000=0.00700, 10000=0.00400 (USD); Mount: Surface Mount; Case/Package: 0805; Number of Pins: 2; Min Operating Temperature: -55°C; Max Operating Temperature: 155°C; Tolerance: 1%; Packaging: Cut Tape; Length: 2mm; Width: 1.25mm; Height: 0.5mm; Depth: 1.25mm; REACH SVHC: No SVHC; Lead Free: Lead Free; Supplier Part Number 1: 603-RC0805FR-071ML
R39 R40 = RC0805FR-072K2L: RESISTOR, THICK FILM, 2.2KOHM, 125mW, 1%, FULL REEL; Manufacturer: Yageo; Resistance: 2.2kR; Temperature Coefficient: 100ppm/°C; Voltage Rating (DC): 150V; Supplier 1: Mouser; Manufacturer Part Number: RC0805FR-072K2L; RoHS: Yes; Category: Chip SMD Resistors; Stock 1: 637432; Pricing 1: 1=0.10000, 10=0.03100, 50=0.03100, 100=0.01200, 1000=0.00700, 10000=0.00400 (USD); Case/Package: 0805; Number of Pins: 2; Case Code (Imperial): 0805; Case Code (Metric): 2012; Size Code: 0805; Min Operating Temperature: -55°C; Max Operating Temperature: 155°C; Resistor Type: Thick Film; Tolerance: 1%; Packaging: Tape and Reel; Power Rating: 125mW; Voltage Rating: 150V; Package Quantity: 1; Termination: SMD/SMT; Number of Terminations: 2; Max Power Dissipation: 125mW; Features: Moisture Resistant; Series: RC; Construction: Rectangular; Technology: THICK FILM; Resistance Tolerance: 1%; Length: 2mm; Width: 1.25mm; Height: 0.5mm; Depth: 1.25mm; Lead Pitch: 0.4mm; REACH SVHC: No SVHC; Lead Free: Lead Free; RoHS Compliant: Yes; Military Standard: Not; ComponentLink1URL: https://datasheet.ciiva.com/7660/38627-7660800.pdf?src-supplier=Element14; ComponentLink1Description: https://datasheet.ciiva.com/7660/38627-7660800.pdf?src-supplier=Element14; ComponentLink2URL: https://datasheet.ciiva.com/11808/0900766b8106beab-11808373.pdf?src-supplier=RSComponents; ComponentLink2Description: https://datasheet.ciiva.com/11808/0900766b8106beab-11808373.pdf?src-supplier=RSComponents; ComponentLink3URL: https://datasheet.ciiva.com/46447/444164-46447575.pdf?src-supplier=Element14; ComponentLink3Description: https://datasheet.ciiva.com/46447/444164-46447575.pdf?src-supplier=Element14; ComponentLink4URL: https://datasheet.ciiva.com/2457/pyu-r-int-thick-7-2457002.pdf?src-supplier=Digi-Key; ComponentLink4Description: https://datasheet.ciiva.com/2457/pyu-r-int-thick-7-2457002.pdf?src-supplier=Digi-Key; ComponentLink5URL: https://datasheet.ciiva.com/7941/444164-7941754.pdf?src-supplier=Element14; ComponentLink5Description: https://datasheet.ciiva.com/7941/444164-7941754.pdf?src-supplier=Element14; ComponentLink6URL: https://datasheet.ciiva.com/2457/pyu-r-int-thick-7-2457003.pdf?src-supplier=Digi-Key; ComponentLink6Description: https://datasheet.ciiva.com/2457/pyu-r-int-thick-7-2457003.pdf?src-supplier=Digi-Key; ComponentLink7URL: https://datasheet.ciiva.com/7941/444164-7941755.pdf?src-supplier=Element14; ComponentLink7Description: https://datasheet.ciiva.com/7941/444164-7941755.pdf?src-supplier=Element14; ComponentLink8URL: https://datasheet.ciiva.com/2457/pyu-r-int-thick-7-2457004.pdf?src-supplier=Digi-Key; ComponentLink8Description: https://datasheet.ciiva.com/2457/pyu-r-int-thick-7-2457004.pdf?src-supplier=Digi-Key; ComponentLink9URL: https://datasheet.ciiva.com/46412/444164-46412862.pdf?src-supplier=Element14; ComponentLink9Description: https://datasheet.ciiva.com/46412/444164-46412862.pdf?src-supplier=Element14; Supplier Part Number 1: 603-RC0805FR-072K2L